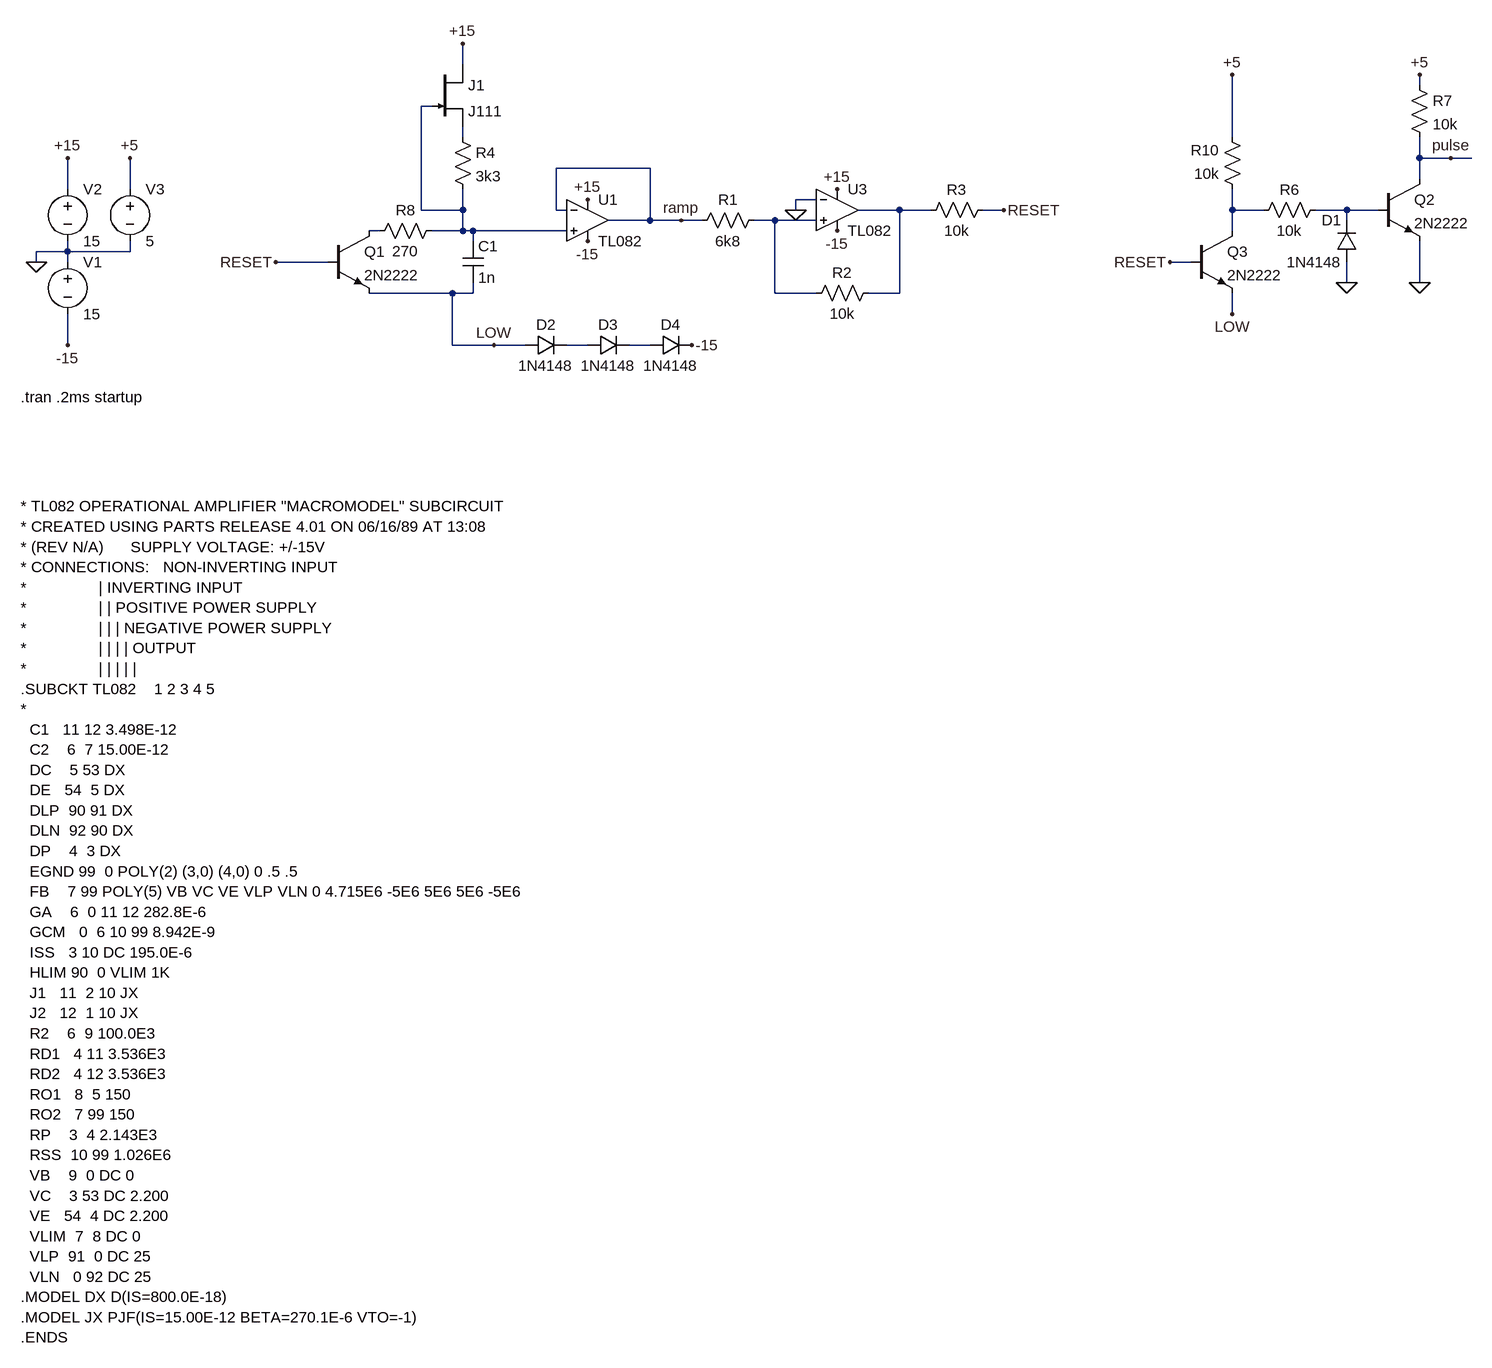
[diagram p0: schematic osc_ramp.asc]
osc_ramp.asc, the LTspice schematic file:
Version 4
SHEET 1 2000 1700
WIRE 432 -144 432 -176
WIRE 1904 -112 1904 -128
WIRE 384 -80 368 -80
WIRE 432 -32 432 -48
WIRE 1616 -32 1616 -128
WIRE 1904 0 1904 -32
WIRE 1952 0 1904 0
WIRE 1984 0 1952 0
WIRE 720 16 576 16
WIRE 1904 32 1904 0
WIRE -176 48 -176 0
WIRE -80 48 -80 0
WIRE 976 64 944 64
WIRE 368 80 368 -80
WIRE 432 80 432 48
WIRE 432 80 368 80
WIRE 576 80 576 16
WIRE 592 80 576 80
WIRE 944 80 944 64
WIRE 1104 80 1040 80
WIRE 1152 80 1104 80
WIRE 1264 80 1232 80
WIRE 1616 80 1616 48
WIRE 1664 80 1616 80
WIRE 1792 80 1744 80
WIRE 1840 80 1792 80
WIRE 720 96 720 16
WIRE 720 96 656 96
WIRE 768 96 720 96
WIRE 800 96 768 96
WIRE 912 96 880 96
WIRE 976 96 912 96
WIRE 1792 96 1792 80
WIRE 304 112 288 112
WIRE 432 112 432 80
WIRE 432 112 384 112
WIRE 448 112 432 112
WIRE 592 112 448 112
WIRE 1616 112 1616 80
WIRE 448 128 448 112
WIRE -176 144 -176 128
WIRE -176 144 -224 144
WIRE -80 144 -80 128
WIRE -80 144 -176 144
WIRE -224 160 -224 144
WIRE -176 160 -176 144
WIRE 224 160 144 160
WIRE 1552 160 1520 160
WIRE 1792 192 1792 160
WIRE 1904 192 1904 128
WIRE 416 208 288 208
WIRE 448 208 448 192
WIRE 448 208 416 208
WIRE 912 208 912 96
WIRE 976 208 912 208
WIRE 1104 208 1104 80
WIRE 1104 208 1056 208
WIRE 1616 240 1616 208
WIRE -176 288 -176 240
WIRE 416 288 416 208
WIRE 480 288 416 288
WIRE 528 288 480 288
WIRE 624 288 592 288
WIRE 720 288 688 288
FLAG -224 160 0
FLAG -176 0 +15
FLAG -176 288 -15
FLAG 1008 48 +15
FLAG 1008 112 -15
FLAG 624 64 +15
FLAG 624 128 -15
FLAG 944 80 0
FLAG 768 96 ramp
FLAG 432 -176 +15
FLAG 784 288 -15
FLAG 1792 192 0
FLAG 1904 192 0
FLAG 1904 -128 +5
FLAG 1952 0 pulse
FLAG 1616 -128 +5
FLAG 480 288 LOW
FLAG 1264 80 RESET
FLAG 1616 240 LOW
FLAG 1520 160 RESET
FLAG 144 160 RESET
FLAG -80 0 +5
SYMBOL voltage -176 144 R0
SYMATTR InstName V1
SYMATTR Value 15
SYMBOL voltage -176 32 R0
SYMATTR InstName V2
SYMATTR Value 15
SYMBOL Opamps\\opamp2 1008 16 R0
SYMATTR InstName U3
SYMATTR Value TL082
SYMBOL Opamps\\opamp2 624 32 R0
SYMATTR InstName U1
SYMATTR Value TL082
SYMBOL res 896 80 R90
WINDOW 0 0 56 VBottom 2
WINDOW 3 32 56 VTop 2
SYMATTR InstName R1
SYMATTR Value 6k8
SYMBOL res 1072 192 R90
WINDOW 0 0 56 VBottom 2
WINDOW 3 32 56 VTop 2
SYMATTR InstName R2
SYMATTR Value 10k
SYMBOL cap 432 128 R0
SYMATTR InstName C1
SYMATTR Value 1n
SYMBOL res 1248 64 R90
WINDOW 0 0 56 VBottom 2
WINDOW 3 32 56 VTop 2
SYMATTR InstName R3
SYMATTR Value 10k
SYMBOL res 416 -48 R0
SYMATTR InstName R4
SYMATTR Value 3k3
SYMBOL njf 384 -144 R0
SYMATTR InstName J1
SYMATTR Value J111
SYMBOL npn 224 112 R0
SYMATTR InstName Q1
SYMATTR Value 2N2222
SYMBOL diode 528 304 R270
WINDOW 0 32 32 VTop 2
WINDOW 3 0 32 VBottom 2
SYMATTR InstName D2
SYMATTR Value 1N4148
SYMBOL diode 624 304 R270
WINDOW 0 32 32 VTop 2
WINDOW 3 0 32 VBottom 2
SYMATTR InstName D3
SYMATTR Value 1N4148
SYMBOL npn 1840 32 R0
SYMATTR InstName Q2
SYMATTR Value 2N2222
SYMBOL diode 1808 160 R180
WINDOW 0 24 64 Left 2
WINDOW 3 24 0 Left 2
SYMATTR InstName D1
SYMATTR Value 1N4148
SYMBOL res 1760 64 R90
WINDOW 0 0 56 VBottom 2
WINDOW 3 32 56 VTop 2
SYMATTR InstName R6
SYMATTR Value 10k
SYMBOL res 1888 -128 R0
SYMATTR InstName R7
SYMATTR Value 10k
SYMBOL res 400 96 R90
WINDOW 0 0 56 VBottom 2
WINDOW 3 32 56 VTop 2
SYMATTR InstName R8
SYMATTR Value 270
SYMBOL diode 720 304 R270
WINDOW 0 32 32 VTop 2
WINDOW 3 0 32 VBottom 2
SYMATTR InstName D4
SYMATTR Value 1N4148
SYMBOL npn 1552 112 R0
SYMATTR InstName Q3
SYMATTR Value 2N2222
SYMBOL res 1632 64 R180
WINDOW 0 36 76 Left 2
WINDOW 3 36 40 Left 2
SYMATTR InstName R10
SYMATTR Value 10k
SYMBOL voltage -80 32 R0
SYMATTR InstName V3
SYMATTR Value 5
TEXT -248 368 Left 2 !.tran .2ms startup
TEXT -248 536 Left 2 !* TL082 OPERATIONAL AMPLIFIER "MACROMODEL" SUBCIRCUIT\n* CREATED USING PARTS RELEASE 4.01 ON 06/16/89 AT 13:08\n* (REV N/A)      SUPPLY VOLTAGE: +/-15V\n* CONNECTIONS:   NON-INVERTING INPUT\n*                | INVERTING INPUT\n*                | | POSITIVE POWER SUPPLY\n*                | | | NEGATIVE POWER SUPPLY\n*                | | | | OUTPUT\n*                | | | | |\n.SUBCKT TL082    1 2 3 4 5\n*\n  C1   11 12 3.498E-12\n  C2    6  7 15.00E-12\n  DC    5 53 DX\n  DE   54  5 DX\n  DLP  90 91 DX\n  DLN  92 90 DX\n  DP    4  3 DX\n  EGND 99  0 POLY(2) (3,0) (4,0) 0 .5 .5\n  FB    7 99 POLY(5) VB VC VE VLP VLN 0 4.715E6 -5E6 5E6 5E6 -5E6\n  GA    6  0 11 12 282.8E-6\n  GCM   0  6 10 99 8.942E-9\n  ISS   3 10 DC 195.0E-6\n  HLIM 90  0 VLIM 1K\n  J1   11  2 10 JX\n  J2   12  1 10 JX\n  R2    6  9 100.0E3\n  RD1   4 11 3.536E3\n  RD2   4 12 3.536E3\n  RO1   8  5 150\n  RO2   7 99 150\n  RP    3  4 2.143E3\n  RSS  10 99 1.026E6\n  VB    9  0 DC 0\n  VC    3 53 DC 2.200\n  VE   54  4 DC 2.200\n  VLIM  7  8 DC 0\n  VLP  91  0 DC 25\n  VLN   0 92 DC 25\n.MODEL DX D(IS=800.0E-18)\n.MODEL JX PJF(IS=15.00E-12 BETA=270.1E-6 VTO=-1)\n.ENDS

The netlist it stands for:
* osc_ramp.asc
V1 0 -15 15
V2 +15 0 15
XU3 N006 0 +15 -15 N003 TL082  ; pins In+ In- V+ V- OUT
XU1 N001 ramp +15 -15 ramp TL082  ; pins In+ In- V+ V- OUT
R1 N006 ramp 6k8
R2 N003 N006 10k
C1 N001 LOW 1n
R3 RESET N003 10k
R4 N002 N001 3k3
J1 +15 N001 N002 J111
Q1 N007 RESET LOW 0 2N2222
D2 LOW N008 1N4148
D3 N008 N009 1N4148
Q2 pulse N005 0 0 2N2222
D1 0 N005 1N4148
R6 N005 N004 10k
R7 +5 pulse 10k
R8 N001 N007 270
D4 N009 -15 1N4148
Q3 N004 RESET LOW 0 2N2222
R10 N004 +5 10k
V3 +5 0 5
.model D D
.lib standard.dio
.model NPN NPN
.model PNP PNP
.lib standard.bjt
.model NJF NJF
.model PJF PJF
.lib standard.jft
.tran .2ms startup
* TL082 OPERATIONAL AMPLIFIER "MACROMODEL" SUBCIRCUIT
* CREATED USING PARTS RELEASE 4.01 ON 06/16/89 AT 13:08
* (REV N/A)      SUPPLY VOLTAGE: +/-15V
* CONNECTIONS:   NON-INVERTING INPUT
*                | INVERTING INPUT
*                | | POSITIVE POWER SUPPLY
*                | | | NEGATIVE POWER SUPPLY
*                | | | | OUTPUT
*                | | | | |
.SUBCKT TL082    1 2 3 4 5
*
  C1   11 12 3.498E-12
  C2    6  7 15.00E-12
  DC    5 53 DX
  DE   54  5 DX
  DLP  90 91 DX
  DLN  92 90 DX
  DP    4  3 DX
  EGND 99  0 POLY(2) (3,0) (4,0) 0 .5 .5
  FB    7 99 POLY(5) VB VC VE VLP VLN 0 4.715E6 -5E6 5E6 5E6 -5E6
  GA    6  0 11 12 282.8E-6
  GCM   0  6 10 99 8.942E-9
  ISS   3 10 DC 195.0E-6
  HLIM 90  0 VLIM 1K
  J1   11  2 10 JX
  J2   12  1 10 JX
  R2    6  9 100.0E3
  RD1   4 11 3.536E3
  RD2   4 12 3.536E3
  RO1   8  5 150
  RO2   7 99 150
  RP    3  4 2.143E3
  RSS  10 99 1.026E6
  VB    9  0 DC 0
  VC    3 53 DC 2.200
  VE   54  4 DC 2.200
  VLIM  7  8 DC 0
  VLP  91  0 DC 25
  VLN   0 92 DC 25
.MODEL DX D(IS=800.0E-18)
.MODEL JX PJF(IS=15.00E-12 BETA=270.1E-6 VTO=-1)
.ENDS
.backanno
.end